# EAGLE schematic PCB_v1 (EAGLE 7.4.0)
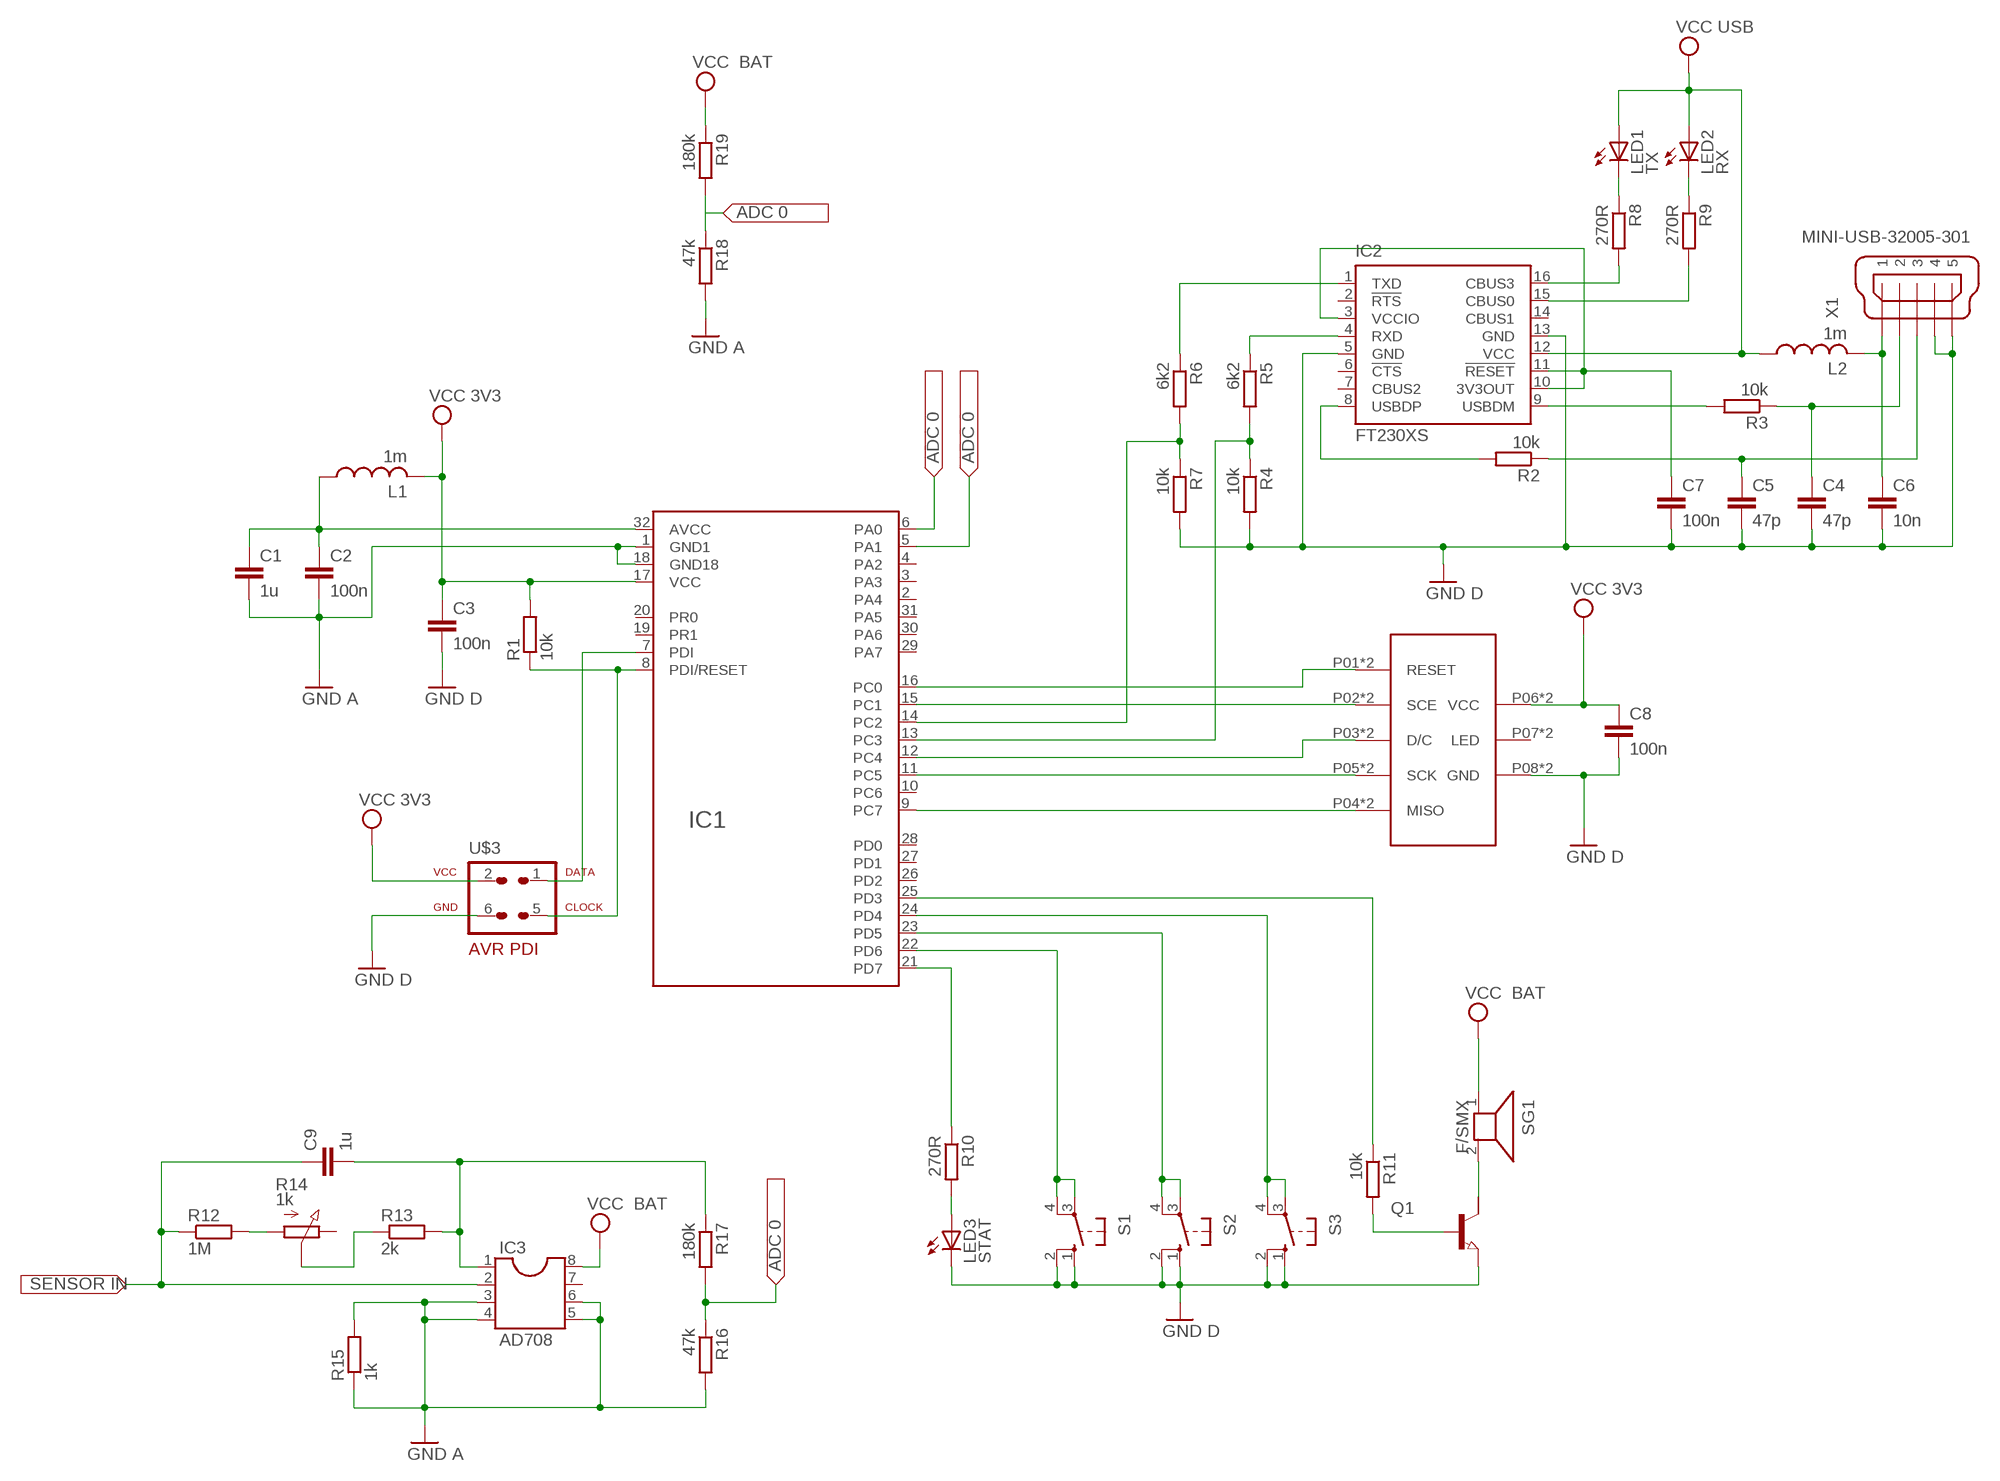
[diagram p0: schematic, sheet 1]

## Parts
3310  3310  [3310]
C1  1u  C  [C0805]
C2  100n  C  [C0805]
C3  100n  C  [C0805]
C4  47p  C  [C0805]
C5  47p  C  [C0805]
C6  10n  C  [C0805]
C7  100n  C  [C0805]
C8  100n  C  [C0805]
C9  1u  C  [C0805]
IC1  ATXMEGA32E5/16E5/8E5ATXMEGA32E5-AU  [TQFP32-08]
IC2  FT230XS  [SSOP16]
IC3  AD708  DIL8  [DIL08]
L1  1m  L-USL2012C  [L2012C]
L2  1m  L-USL2012C  [L2012C]
LED1  TX  LED_E  [LED_1206]
LED2  RX  LED_E  [LED_1206]
LED3  STAT  LED_E  [LED_1206]
Q1  NPN-TRANSISTIOR-2COLSOT143  [SOT143]
R1  10k  RR3216  [R3216]
R2  10k  RR3216  [R3216]
R3  10k  RR3216  [R3216]
R4  10k  RR3216  [R3216]
R5  6k2  RR3216  [R3216]
R6  6k2  RR3216  [R3216]
R7  10k  RR3216  [R3216]
R8  270R  RR3216  [R3216]
R9  270R  RR3216  [R3216]
R10  270R  RR3216  [R3216]
R11  10k  RR3216  [R3216]
R12  1M  RR3216  [R3216]
R13  2k  RR3216  [R3216]
R14  1k  PC25  [PC25]
R15  1k  RR3216  [R3216]
R16  47k  RR3216  [R3216]
R17  180k  RR3216  [R3216]
R18  47k  RR3216  [R3216]
R19  180k  RR3216  [R3216]
S1  40-XX  [B3F-40XX]
S2  40-XX  [B3F-40XX]
S3  40-XX  [B3F-40XX]
SG1  F/SMX  [F/SMX]
U$3  AVR-PDIHORZ  [AVR-ISP-6R]
X1  MINI-USB-32005-301  [32005-301]

## Nets
GND: 3310.P08(GND) 3310.P18(GND) C1.2 C2.2 C3.2 C4.2 C5.2 C6.2 C7.2 C8.2 IC1.1(GND1) IC1.18(GND18) IC2.5(GND) IC2.13(GND) IC3.3 IC3.4 IC3.5 IC3.6 LED3.C Q1.3(E) R4.2 R7.2 R15.1 R15.2 R16.2 R18.2 S1.1(S) S1.2(S1) S2.1(S) S2.2(S1) S3.1(S) S3.2(S1) U$3.6 X1.4 X1.5 ; supply symbol labelled GND D, GND A
N$1: 3310.P01(RESET) 3310.P11(RESET) IC1.16(PC0)
N$2: 3310.P02(SCE) 3310.P12(SCE) IC1.15(PC1)
N$3: 3310.P03(D/C) 3310.P13(D/C) IC1.12(PC4)
N$4: 3310.P05(SCK) 3310.P15(SCK) IC1.11(PC5)
N$5: 3310.P04(MISO) 3310.P14(MISO) IC1.9(PC7)
N$6: C1.1 C2.1 IC1.32(AVCC) L1.1
N$7: IC1.24(PD4) S3.3(P) S3.4(P1)
N$8: IC1.14(PC2) R6.2 R7.1
N$9: C4.1 R3.1 X1.2
N$10: C5.1 R2.1 X1.3
N$11: IC1.7(PDI) U$3.1
N$12: IC1.8(PDI/RESET) R1.1 U$3.5
N$13: IC2.8(USBDP) R2.2
N$14: IC2.9(USBDM) R3.2
N$15: C6.1 L2.2 X1.1
N$16: C7.1 IC2.3(VCCIO) IC2.10(3V3OUT) IC2.11(!RESET)
N$17: IC2.1(TXD) R6.1
N$18: IC2.4(RXD) R5.1
N$19: IC1.13(PC3) R4.1 R5.2
N$20: LED1.C R8.1
N$21: IC2.16(CBUS3) R8.2
N$22: IC2.15(CBUS0) R9.2
N$23: LED2.C R9.1
N$24: IC1.23(PD5) S2.3(P) S2.4(P1)
N$25: IC1.22(PD6) S1.3(P) S1.4(P1)
N$26: LED3.A R10.2
N$27: IC1.21(PD7) R10.1
N$28: Q1.2(C) SG1.2
N$29: R12.2 R14.A
N$30: Q1.1(B) R11.2
N$31: IC1.25(PD3) R11.1
N$32: IC1.6(PA0)
N$33: R13.1 R14.S
N$34: C9.2 IC3.1 R13.2 R17.1
N$35: C9.1 IC3.2 R12.1
N$36: R16.1 R17.2
N$37: IC1.5(PA1)
N$39: R18.1 R19.2
VCC: 3310.P06(VCC) 3310.P16(VCC) C3.1 C8.1 IC1.17(VCC) IC2.12(VCC) IC3.8 L1.2 L2.1 LED1.A LED2.A R1.2 R19.1 SG1.1 U$3.2 ; supply symbol labelled VCC 3V3, VCC USB, VCC BAT
Unconnected: 3310.P07(LED) 3310.P17(LED) IC1.2(PA4) IC1.3(PA3) IC1.4(PA2) IC1.10(PC6) IC1.19(PR1) IC1.20(PR0) IC1.26(PD2) IC1.27(PD1) IC1.28(PD0) IC1.29(PA7) IC1.30(PA6) IC1.31(PA5) IC2.2(!RTS) IC2.6(!CTS) IC2.7(CBUS2) IC2.14(CBUS1) IC3.7 Q1.4(C/) R14.E

## Library data of the parts
3310 = 3310LCD:3310: 3310 LCD
C1-C9 = eagle-ltspice:C: CAPACITOR, European symbol; SPICEMODEL: NONE; SPICEPREFIX: C
IC1 = atmega-atxmega:ATXMEGA32E5/16E5/8E5: 8/16-bit Atmel AVR XMEGA Microcontrollers
IC2 = ftdichip:FT230X: USB to BASIC UART IC Auto generated by make-symbol-device-package-bsdl.ulp Rev. 43 Source: Data sheet <http://www.ftdichip.com/Support/Documents/DataSheets/ICs/DS_FT230X.pdf>
IC3 = ic-package:DIL8: Dual In Line / Socket
L1 L2 = rcl:L-US: INDUCTOR, American symbol
LED1-LED3 = eagle-ltspice:LED_E: LED Source: http://www.osram.convergy.de Source: www.luxeon.com Source: www.kingbright.com; SPICEMODEL: NONE; SPICEPREFIX: D; SPICETYPE: diode
Q1 = semicon-smd-ipc:NPN-TRANSISTIOR-2COL: NPN TRANSISTOR 2 colletor pins
R1-R13 R15-R19 = eagle-ltspice:R: RESISTOR, European symbol; SPICEMODEL: NONE; SPICEPREFIX: R
R14 = pot-vitrohm:PC25: VITROHM POTENTIOMETER; MF: CLAROSTAT; MPN: 308NPC25KS; OC_FARNELL: 1440998; OC_NEWARK: 03F7518
S1-S3 = switch-omron:40-XX: OMRON SWITCH; MF: OMRON COMPONENTS USA; MPN: B3F-4000; OC_FARNELL: 176434; OC_NEWARK: 36K3105
SG1 = buzzer:F/SMX: BUZZER Source: Buerklin; OC_FARNELL: unknown; OC_NEWARK: unknown
U$3 = atmega-atxmega:AVR-PDI: AVR PDI programming interface connector
X1 = con-cypressindustries:MINI-USB-: MINI USB-B Conector Source: www.cypressindustries.com; OC_FARNELL: unknown; OC_NEWARK: unknown